# EAGLE design 1605_lora_ES920 (EAGLE 9.6.2)
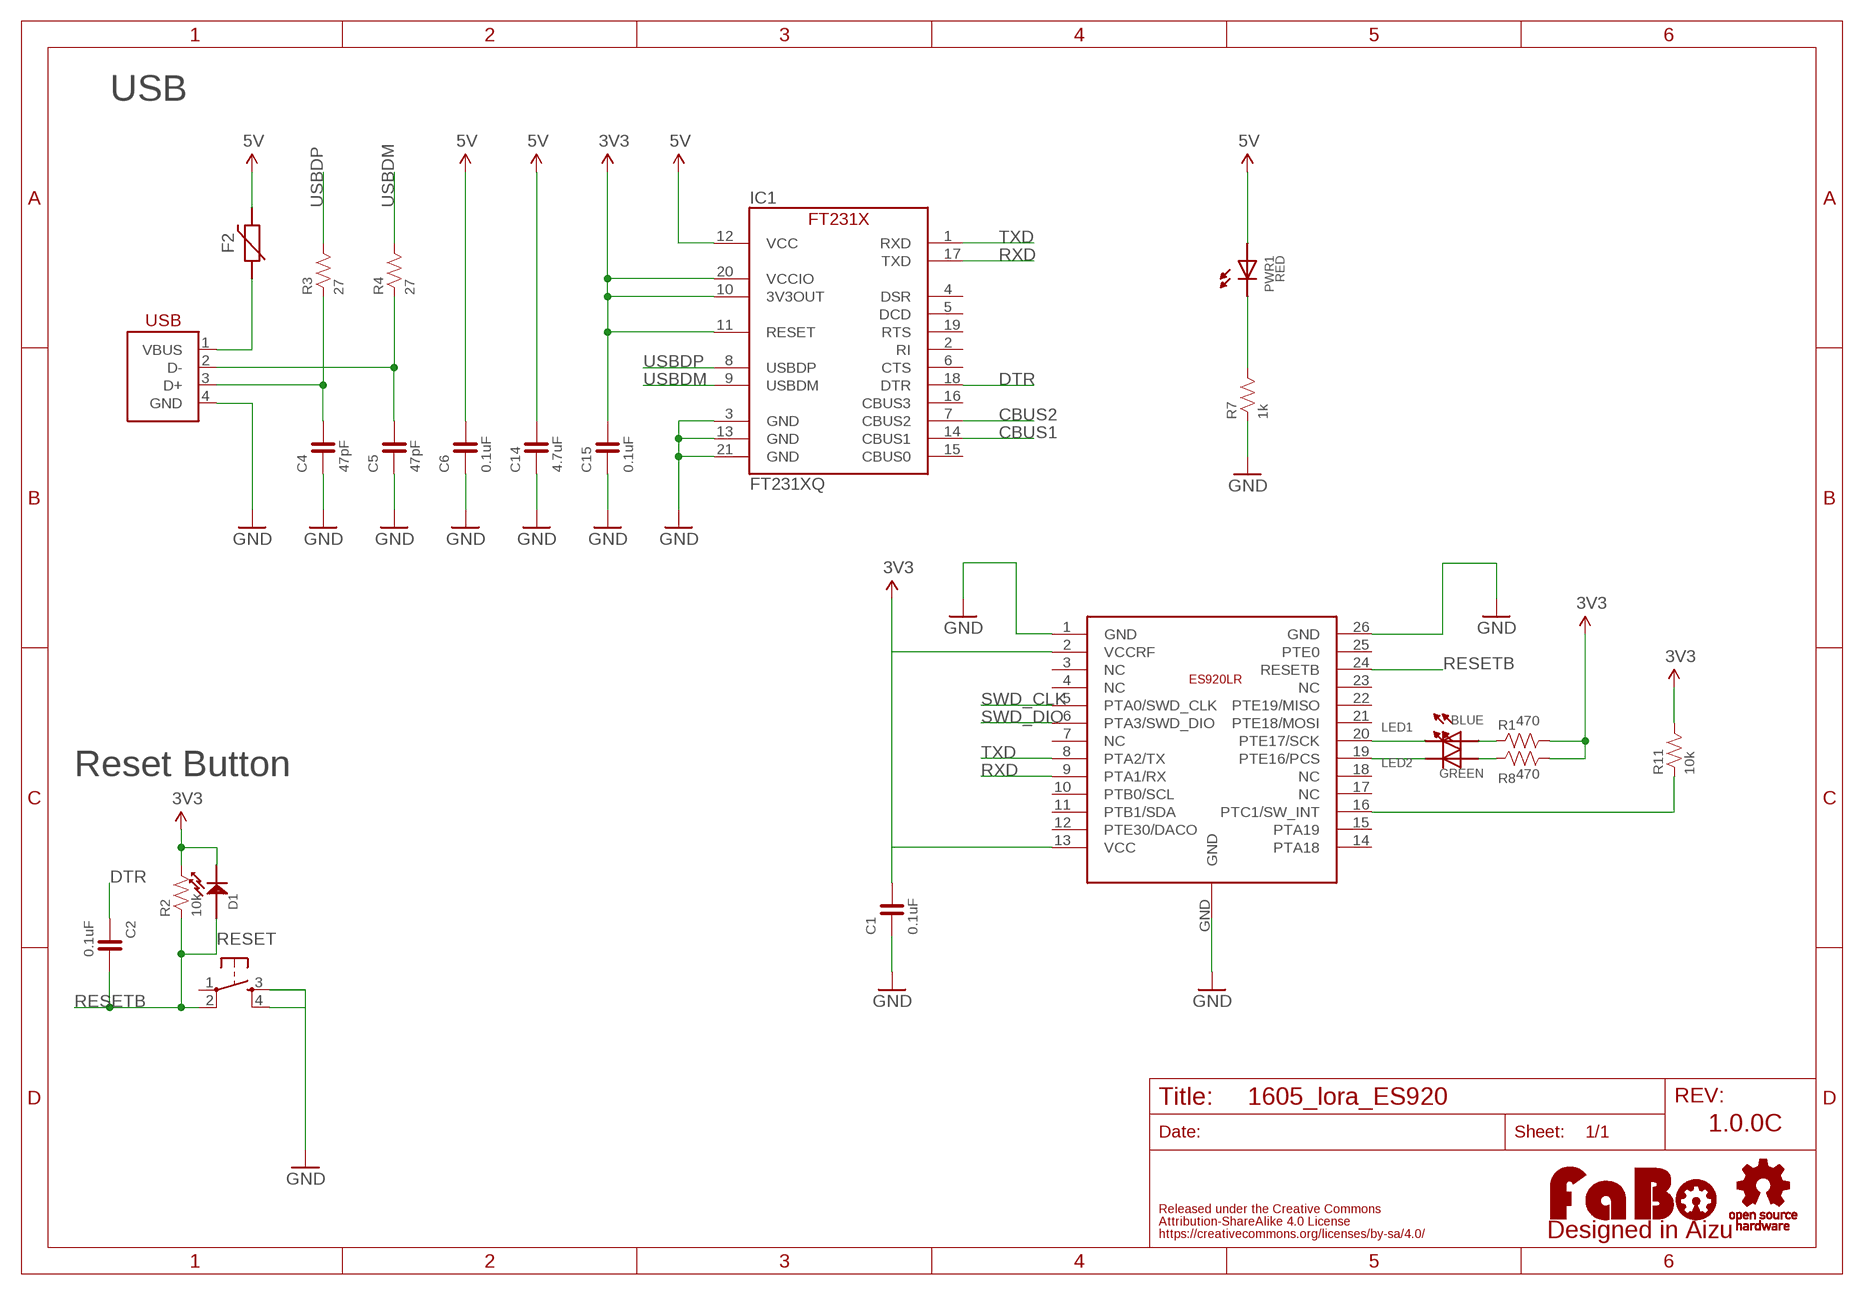
[diagram p0: schematic, sheet 1]

## Parts
C1  0.1uF  CAPACITOR-0603_NARROW  [0603-NARROW]
C2  0.1uF  CAPACITOR-0603_NARROW  [0603-NARROW]
C4  47pF  CAPACITOR-0603_NARROW  [0603-NARROW]
C5  47pF  CAPACITOR-0603_NARROW  [0603-NARROW]
C6  0.1uF  CAPACITOR-0603_NARROW  [0603-NARROW]
C14  4.7uF  CAPACITOR-0603_NARROW  [0603-NARROW]
C15  0.1uF  CAPACITOR-0603_NARROW  [0603-NARROW]
D1  DIODE0603  [0603]
F2  POLYSWITCH  [NANOSMDC035F]
IC1  FT231XQ  [QFN-20_FT231X]
LED1  BLUE  LED-0603  [0603]
LED2  GREEN  LED-0603  [0603]
PWR1  RED  LED-0603-NARROW  [0603-NARROW]
R1  470  RESISTOR-0603-NARROW  [0603-NARROW]
R2  10k  RESISTOR-0603-NARROW  [0603-NARROW]
R3  27  RESISTOR-0603-NARROW  [0603-NARROW]
R4  27  RESISTOR-0603-NARROW  [0603-NARROW]
R7  1k  RESISTOR-0603-NARROW  [0603-NARROW]
R8  470  RESISTOR-0603-NARROW  [0603-NARROW]
R11  10k  RESISTOR-0603-NARROW  [0603-NARROW]
RESET  TACT-SWITCH-SMD_KMR2  [KMR2]
U$2  LOGO_OSHW-M_BOTTOM  [LOGO_OSHW_M_BOTTOM]
U$4  ES920LR  [ES920LR]
U$5  LOGO_FABO-M  [LOGO_FABO_MS]
USB1  USB-B_PTH  [USB-4AF103BS]

## Nets
3V3: C1.2 C15.2 D1.CATHODE IC1.10(3V3OUT) IC1.11(RESET) IC1.20(VCCIO) R1.2 R2.2 R8.2 R11.2 U$4.2(VCCRF) U$4.13(VCC)
5V: C6.2 C14.2 F2.2 IC1.12(VCC) PWR1.ANODE
CBUS1: IC1.14(CBUS1)
CBUS2: IC1.7(CBUS2)
DTR: C2.1 IC1.18(DTR)
GND: C1.1 C4.1 C5.1 C6.1 C14.1 C15.1 IC1.3(GND) IC1.13(GND) IC1.21(GND) R7.1 RESET.3 RESET.4 U$4.1(GND) U$4.26(GND) U$4.GND USB1.4(GND)
N$3: LED2.CATHODE U$4.19(PTE16/PCS)
N$4: LED1.CATHODE U$4.20(PTE17/SCK)
N$5: LED1.ANODE R1.1
N$6: LED2.ANODE R8.1
N$7: C5.2 R4.1 USB1.2(D-)
N$8: C4.2 R3.1 USB1.3(D+)
N$11: PWR1.CATHODE R7.2
N$12: R11.1 U$4.16(PTC1/SW_INT)
RESETB: C2.2 D1.ANODE R2.1 RESET.2 U$4.24(RESETB)
RXD: IC1.17(TXD) U$4.9(PTA1/RX)
SWD_CLK: U$4.5(PTA0/SWD_CLK)
SWD_DIO: U$4.6(PTA3/SWD_DIO)
TXD: IC1.1(RXD) U$4.8(PTA2/TX)
USBDM: IC1.9(USBDM) R4.2
USBDP: IC1.8(USBDP) R3.2
VBUS1: F2.1 USB1.1(VBUS)
Unconnected: IC1.2(RI) IC1.4(DSR) IC1.5(DCD) IC1.6(CTS) IC1.15(CBUS0) IC1.16(CBUS3) IC1.19(RTS) RESET.1 U$4.3(NC) U$4.4(NC) U$4.7(NC) U$4.10(PTB0/SCL) U$4.11(PTB1/SDA) U$4.12(PTE30/DACO) U$4.14(PTA18) U$4.15(PTA19) U$4.17(NC) U$4.18(NC) U$4.21(PTE18/MOSI) U$4.22(PTE19/MISO) U$4.23(NC) U$4.25(PTE0)

## Notes on the sheet
- USB
- Reset Button
- 1.0.0C

## Library data of the parts
C1 C2 C4-C6 C14 C15 = FaBo-Capacitor:CAPACITOR: CAPACITOR
D1 = FaBo-Diode:DIODE
F2 = FaBo-Parts:POLYSWITCH
IC1 = FaBo-USB:FT231X
LED1 LED2 PWR1 = FaBo-LED:LED
R1-R4 R7 R8 R11 = FaBo-Resistors:RESISTOR: RESISTOR
RESET = FaBo-Switch:TACT-SWITCH: Part No Maker Datasheet Distributor 1273HA-160G-G SWITRONIC Catalog <http://www.switronic.com/uploads/images/A10.gif> Akizuki <http://akizukidenshi.com/catalog/g/gP-02561/> DTS-6-V Cosland DTS 6 Series <http://www.cosland.com/newproduct/DTS%20SERIES.pdf> Akizuki <http://akizukidenshi.com/catalog/g/gP-03647/> KMR2 C&K KMR2 SERIES <https://www.ckswitches.com/products/switches/product-details/Tactile/KMR2/> Octoparts Result <https://octopart.com/search?q=KMR2&start=0> TSHA-T-XB2-19E TOP UP INDUSTORY TSHA-T <http://www.top-up.com.tw/front/bin/ptdetail.phtml?Part=TSHA-T> Akizuki <http://akizukidenshi.com/catalog/g/gP-09361/>
U$2 = FaBo-Logo:LOGO_OSHW
U$4 = FaBo-LoRa:ES920LR
U$5 = FaBo-Logo:LOGO_FABO
USB1 = FaBo-USB:USB: Parts No Maker Datasheet Distributor B05B-PASK-1 JST Datasheet <http://www.jst-mfg.com/product/pdf/eng/ePA-F.pdf> Octoparts Result <https://octopart.com/search?q=B05B-PASK-1> DX4R005JJ2R1800 JAE Datasheet <https://www.jae.com/z-jp/product_jp.cfm?l_code=JA&series_code=DX4&product_number=DX4R005JJ2R1800> Octoparts Result <https://octopart.com/dx4r005jj2r1800-jae+electronics-22232443> S04B-PASK-2 JST Web <http://www.jst-mfg.com/product/detail.php?series=189> Octoparts Result <https://octopart.com/search?q=S04B-PASK-2&start=0> USB-4AF103BS Useconn Electronics Datasheet <http://akizukidenshi.com/download/ds/useconn/USB-4AF103BS-Rev_C.PDF> Akizuki <http://akizukidenshi.com/catalog/g/gC-11551/> USB-A-4P-MALE(1734028-1) TE Web <http://www.te.com/jpn-ja/product-1734028-1.html> Octopart Result <https://octopart.com/1734028-1-te+connectivity-40535237> USB2-AF-WTP-CS-QRFL VPI Datasheet <https://www.vpi.us/dpdf/70/usb2-af-wtp-cs-qrfl.pdf> VPI Store <https://www.vpi.us/usba-waterproof/waterproof-usb-typeb-qrfl-357> ZX62R-B-5P VPI Web <https://www.hirose.com/product/jp/products/ZX/ZX62R-B-5P(30)/> Octopart Result <https://octopart.com/zx62d-b-5p8%2830%29-hirose-70111550>

## Board
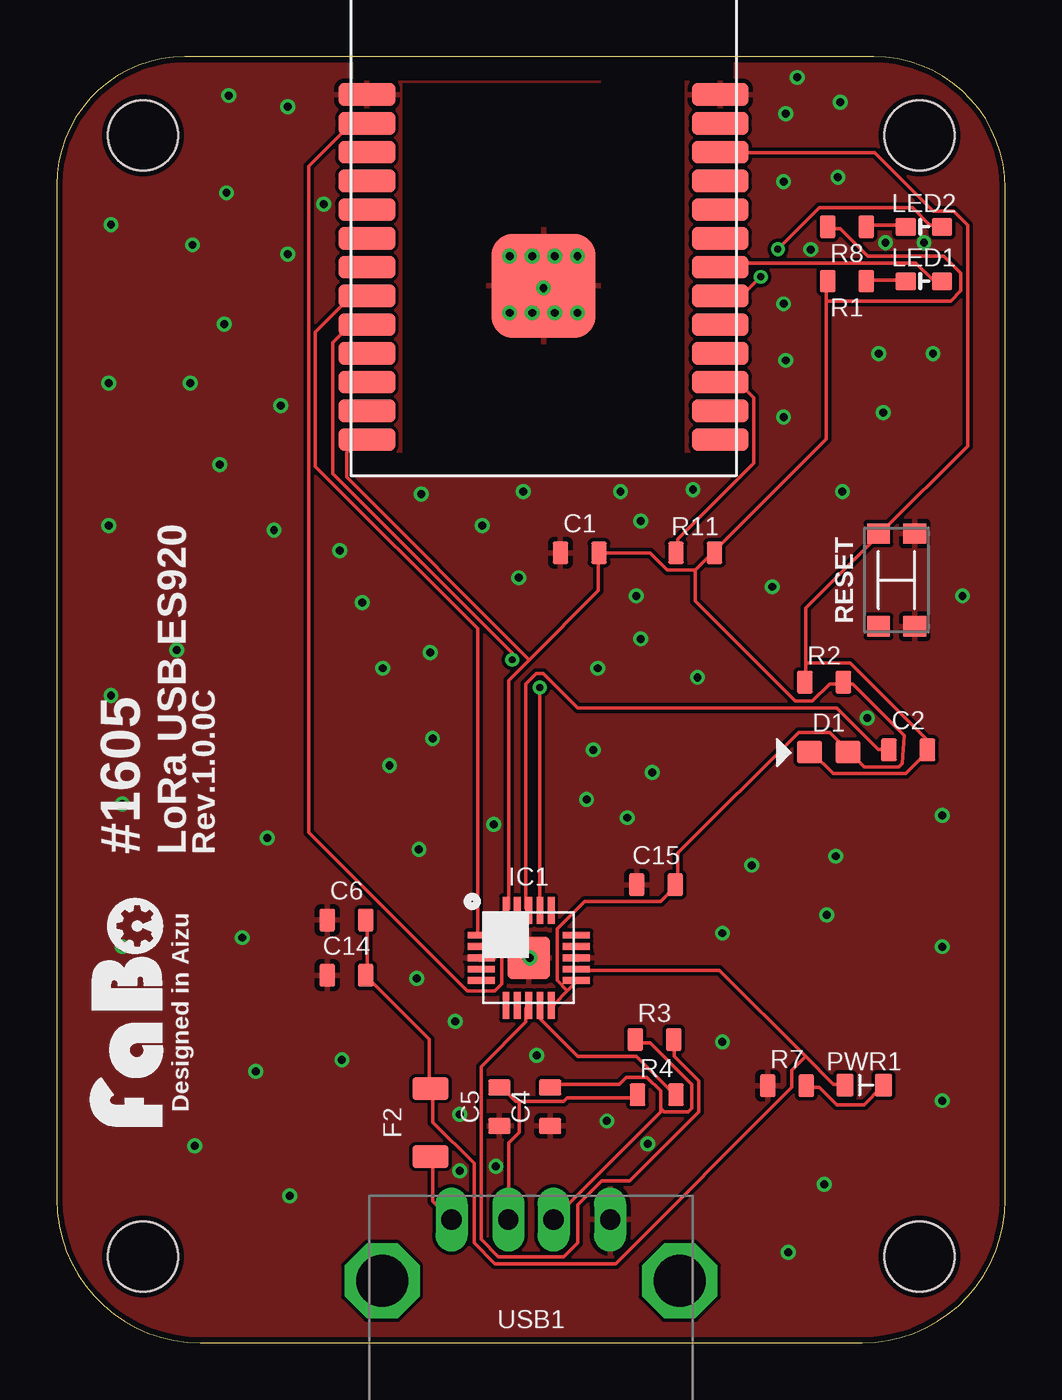
[diagram p1: board, top side]
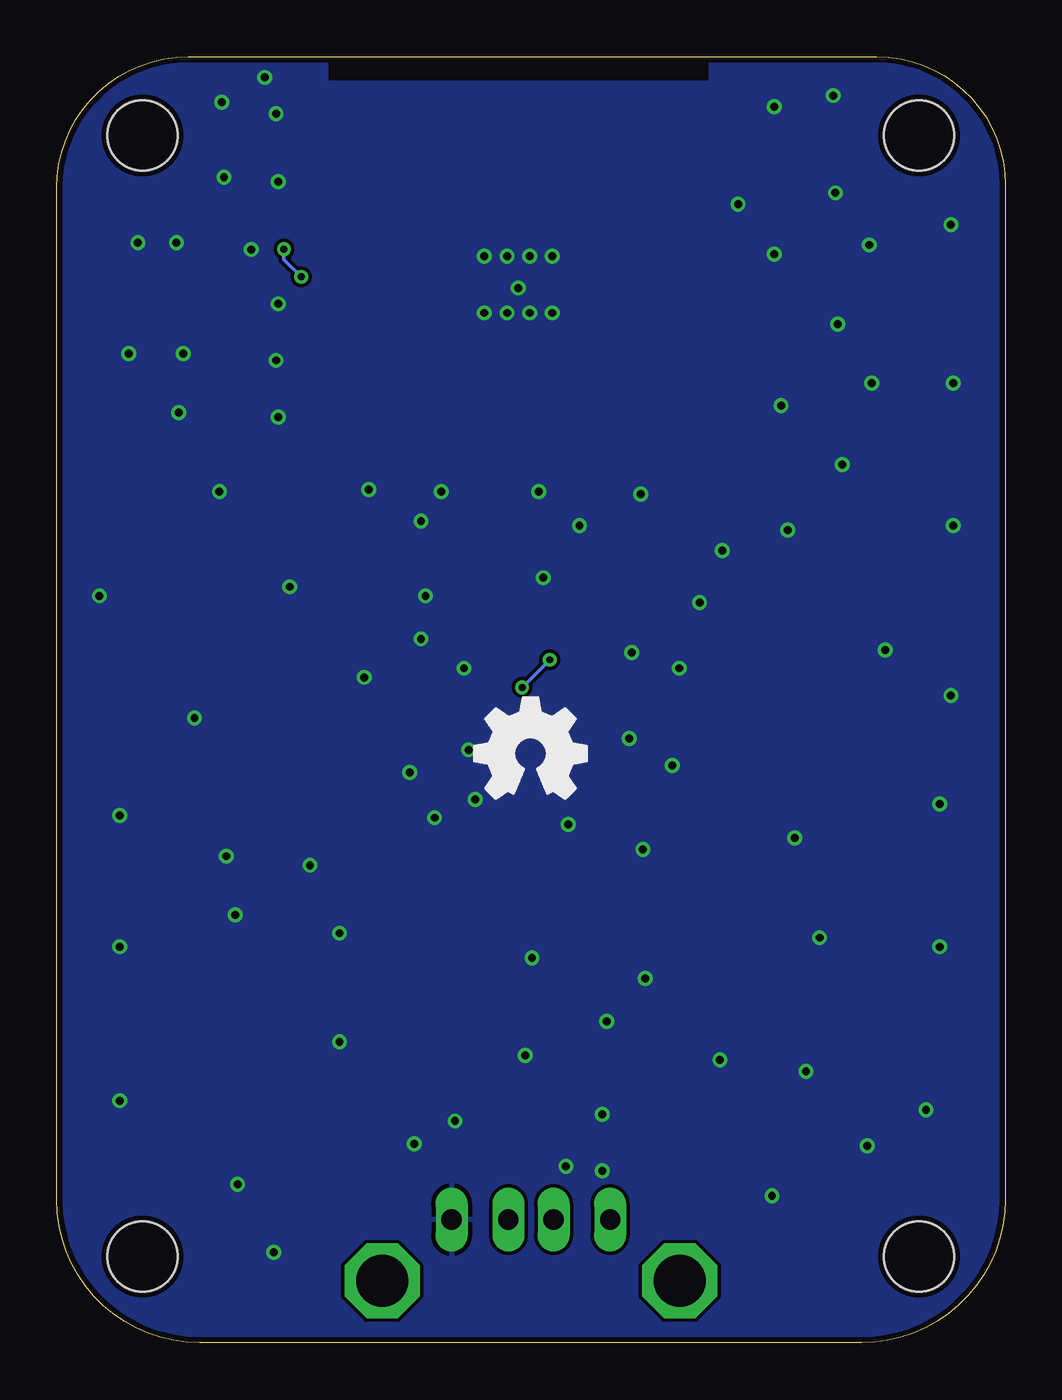
[diagram p2: board, bottom side, seen from below]

Size 41.89 x 56.82 mm. Coordinates in mm from the lower left corner, seen from the top.
Outline: 0,51.16 0,6.35 arc90 6.35,0 35.57,0 arc90 41.89,6.32 41.89,51.01 arc90 36.08,56.82 5.67,56.82 arc90 0,51.16
Copper layers (1*16): Top 0.035mm / dielectric 1.6mm / Bottom 0.035mm
Design rules "PCBway": minimum track width 6mil, minimum drill 12mil, track to track 6mil, track to pad 6mil, pad to pad 6mil, via to via 6mil, smd to smd 6mil, copper to edge 10mil, drill to drill 10mil, minimum pad ring 10mil, minimum via ring 6mil, stop-mask expansion 2mil, vias tented up to drill 100mil, thermal gap 8mil
Holes 3.1 mm at 3.81,53.34 38.1,53.34 38.1,3.81 3.81,3.81

### Footprints (pad centres in the part's own frame; a part is rotated, then mirrored left to right if it is on the bottom)
0603-NARROW = smd 0.71 x 1: 1 -0.85,0; 2 0.85,0
0603 = smd 1.1 x 1: ANODE -0.85,0; CATHODE 0.85,0
NANOSMDC035F = smd 1 x 1.6: 1 -1.5,0; 2 1.5,0
QFN-20_FT231X = smd 1.2 x 0.3: 1 -2.1,1; 2 -2.1,0.5; 3 -2.1,0; 4 -2.1,-0.5; 5 -2.1,-1; 11 2.1,-1; 12 2.1,-0.5; 13 2.1,0; 14 2.1,0.5; 15 2.1,1 | smd 0.3 x 1.2: 6 -1,-2.1; 7 -0.5,-2.1; 8 0,-2.1; 9 0.5,-2.1; 10 1,-2.1; 16 1,2.1; 17 0.5,2.1; 18 0,2.1; 19 -0.5,2.1; 20 -1,2.1 | smd 1.9 x 1.9: 21 0,0
0603' = smd 0.9 x 0.8: ANODE -0.8,0; CATHODE 0.8,0
0603-NARROW' = smd 0.75 x 1: ANODE -0.85,0; CATHODE 0.85,0
KMR2 = smd 0.9 x 1: 1 -2.05,0.8; 2 2.05,0.8; 3 2.05,-0.8; 4 -2.05,-0.8
ES920LR = smd 2.5 x 1: 1 -7.8,5.84; 2 -7.8,4.57; 3 -7.8,3.3; 4 -7.8,2.03; 5 -7.8,0.76; 6 -7.8,-0.51; 7 -7.8,-1.78; 8 -7.8,-3.05; 9 -7.8,-4.32; 10 -7.8,-5.59; 11 -7.8,-6.86; 12 -7.8,-8.13; 13 -7.8,-9.4; 14 7.8,-9.4; 15 7.8,-8.13; 16 7.8,-6.86; 17 7.8,-5.59; 18 7.8,-4.32; 19 7.8,-3.05; 20 7.8,-1.78; 21 7.8,-0.51; 22 7.8,0.76; 23 7.8,2.03; 24 7.8,3.3; 25 7.8,4.57; 26 7.8,5.84 | smd 4.6 x 4.6: GND 0,-2.6
USB-4AF103BS = drill 0.9 long: 1 3.5,0; 2 1,0; 3 -1,0; 4 -3.5,0 | drill 2.3 octagon: P$1 -6.57,2.71; P$2 6.57,2.71

### Placement (x,y rotation side)
C1  23.1,34.9 0 top
C2  37.6,26.2 0 top
C4  21.79,10.43 90 top
C5  19.55,10.43 90 top
C6  12.8,18.68 0 top
C14  12.8,16.24 0 top
C15  26.47,20.24 0 top
D1  34.1,26.1 0 top
F2  16.51,9.73 90 top
IC1  20.84,17.01 0 top
LED1  BLUE  [0603']  38.3,46.9 0 top
LED2  GREEN  [0603']  38.3,49.3 0 top
PWR1  RED  [0603-NARROW']  35.66,11.39 0 top
R1  34.9,46.9 180 top
R2  33.89,29.19 0 top
R3  26.4,13.4 0 top
R4  26.5,10.96 0 top
R7  32.25,11.36 0 top
R8  34.9,49.3 180 top
R11  28.2,34.9 0 top
RESET  37.09,33.7 90 top
U$2  20.95,26.04 0 top
U$4  21.5,49.3 0 top
U$5  5.08,14.61 90 top
USB1  20.95,5.45 180 top

### Tracks (layer width: path | path; a pad name or v marks a point on that pad's centre or on a via)
3V3
  Top 0.152: 22.55,15.54 23.01,16 IC1.11 | 22.55,15.54 21.95,14.94 IC1.10 | 22.55,15.54 22.1,16 22.1,18.29 23.32,19.51 26.67,19.51 27.28,20.12 C15.2 27.43,20.27 27.43,21.64 32.77,26.98 34.14,26.98 34.9,26.21 D1.CATHODE 35.05,26.06 35.66,25.45 37.19,25.45 37.34,25.6 37.44,26.82 35.15,29.11 34.75,29.11 R2.2 34.59,29.11 34.14,29.11 33.38,28.35 32.61,28.35 28.19,32.77 28.19,34.14 | 28.19,34.14 26.98,34.14 26.21,34.9 24.08,34.9 C1.2 23.93,34.9 23.93,33.22 20.88,30.18 | 28.19,34.14 28.96,34.9 R11.2 29.11,35.05 33.98,39.93 33.98,46.02 | 33.98,46.02 33.98,46.79 R1.2 | 33.98,46.02 39.47,46.02 39.93,46.48 39.93,47.24 39.17,48.01 35.81,48.01 34.59,49.23 34.14,49.23 R8.2 | 20.88,30.18 19.96,29.26 19.96,19.2 IC1.20 19.81,19.05 19.66,18.9 19.66,15.85 19.36,15.54 18.14,15.54 11.12,22.55 11.12,51.97 12.95,53.8 13.56,53.8 U$4.2 | 20.88,30.18 12.8,38.25 12.8,39.32 13.26,39.78 13.56,39.78 U$4.13
5V
  Top 0.152: C6.2 13.72,18.59 13.72,16.31 C14.2 13.72,16.15 16.46,13.41 16.46,11.28 F2.2 16.61,11.12 16.61,9.75 18.44,7.92 18.44,4.42 19.36,3.5 24.69,3.5 32.46,11.28 32.46,12.04 33.07,12.65 | 33.07,12.65 29.26,16.46 23.01,16.46 IC1.12 | 33.07,12.65 34.29,11.43 34.75,11.43 PWR1.ANODE
DTR
  Top 0.152: C2.1 36.73,26.21 36.27,26.21 34.44,28.04 23.01,28.04 21.49,29.57 21.18,29.57 20.73,29.11 20.73,19.2 IC1.18
GND  (via drill 0.35)
  other vias: 20,48 21,48 22,48 23,48 23,45.5 22,45.5 21,45.5 20,45.5 11.8,50.3 32.1,51.3 32.2,54.3 10.2,54.6 10.2,48.1 9.9,41.4 9.6,35.9 13.5,32.7 18.8,36.1 25.8,31.1 36.5,41.1 32.2,43.4 19.3,22.9 15.9,16.1 19.4,7.8 17.8,10.1 34,18.9 8.8,12 26.3,25.2 14.7,25.5 16.1,37.5 20.6,37.6 24.9,37.6 32.1,40.9 32.1,45.9 34.5,51.5 34.6,54.8 7.6,55.1 7.5,50.8 7.4,45 7.2,38.8 31.6,33.4 24.3,9.8 29.4,13.3 26.1,8.8 17.8,7.6 21.2,12.7 28.1,37.7 33.3,48.3 38.3,48.6 36.6,48.6 12.5,35 14.4,29.8 20.4,33.8 25.8,36.3 20.9,17 21.5,46.6 9.3,22.3 12.6,12.5 10.3,6.5 6.1,8.7 3.5,10.3 2.9,23.8 2.3,36.1 2.4,49.4 6,48.5 38.7,43.7 34.7,37.6 40,33 39.1,23.3 39.1,17.5 39.1,10.7 33.9,7 30.7,21.1 23.4,24 35.8,27.6 16,21.8 29.4,18.1 32.3,4 32.7,55.9 5.9,42.4 2.3,42.4 5.3,30.6 2.4,28.6 8.2,17.9 2.9,17.5 17.6,14.2 16.6,26.7 16.5,30.5 23.7,26.2 25.2,23.2 28.3,29.4 23.9,29.8 25.6,33 36.3,43.7 34.4,21.5
  pour Top: 0,0 42,0 42,57 0,57
  pour Bottom: 0,0 42,0 42,57 0,57
N$3  (via drill 0.3)
  Top 0.152: v31.85,48.31 33.68,50.14 37.8,50.14 38.56,49.38 39.01,49.38 LED2.CATHODE | v31.09,47.09 30.33,46.33 29.41,46.33 U$4.19
  Bottom 0.152: v31.85,48.31 31.85,47.85 v31.09,47.09
N$4
  Top 0.152: LED1.CATHODE 39.01,46.94 38.71,46.94 37.95,47.7 29.57,47.7 29.41,47.55 U$4.20
N$5
  Top 0.152: LED1.ANODE 37.49,46.94 35.81,46.94 R1.1
N$6
  Top 0.152: LED2.ANODE 37.49,49.38 35.81,49.38 R8.1
N$7
  Top 0.152: 20.42,10.67 20.27,10.67 19.66,11.28 C5.2 | 20.42,10.67 22.4,10.67 22.55,10.82 25.6,10.82 R4.1 | 20.42,10.67 20.42,9.3 19.96,8.84 19.96,5.49 USB1.2
N$8
  Top 0.152: 26.67,10.36 26.67,11.12 26.06,11.73 25.15,11.73 24.84,11.43 21.79,11.43 C4.2 | 26.67,10.36 26.82,10.21 27.89,10.21 28.04,10.36 28.04,11.43 26.21,13.26 25.6,13.26 R3.1 | 26.67,10.36 26.67,10.21 21.95,5.49 USB1.3
N$11
  Top 0.152: R7.2 33.22,11.28 33.68,11.28 34.44,10.52 35.66,10.52 36.42,11.28 PWR1.CATHODE
N$12
  Top 0.152: R11.1 27.43,35.05 27.43,35.51 30.79,38.86 30.79,41.76 30.18,42.37 29.41,42.37 U$4.16
RESETB
  Top 0.152: D1.ANODE 33.38,26.06 34.29,25.15 37.49,25.15 38.41,26.06 C2.2 38.41,26.21 38.41,26.67 35.05,30.02 33.07,30.02 | 33.07,30.02 33.07,32.46 36.27,35.66 RESET.2 36.42,35.81 40.23,39.62 40.23,49.38 39.62,49.99 38.71,49.99 36.12,52.58 29.41,52.58 U$4.24 | 33.07,30.02 33.07,29.26 R2.1
RXD  (via drill 0.3)
  Top 0.152: v21.34,28.96 21.34,19.2 IC1.17 | v20.12,30.18 20.12,30.48 12.19,38.41 12.19,44.2 12.95,44.96 13.56,44.96 U$4.9
  Bottom 0.152: v20.12,30.18 v21.34,28.96
TXD
  Top 0.152: IC1.1 18.59,18.14 18.59,31.55 11.43,38.71 11.43,44.65 12.95,46.18 13.56,46.18 U$4.8
USBDM
  Top 0.152: R4.2 27.28,10.97 25.6,12.65 23.01,12.65 21.34,14.33 21.34,14.78 IC1.9
USBDP
  Top 0.152: R3.2 27.28,13.26 27.28,12.65 28.35,11.58 28.35,10.21 25.3,7.16 24.08,7.16 23.01,6.1 23.01,4.42 22.4,3.81 19.51,3.81 18.75,4.57 18.75,12.19 20.73,14.17 20.73,14.78 IC1.8
VBUS1
  Top 0.152: F2.1 16.61,8.23 16.61,6.25 17.37,5.49 USB1.1

### Text on the board
tPlace: #1605 | LoRa USB ES920 | Rev.1.0.0C | Designed in Aizu